# EAGLE design MidiSwitchPCB (EAGLE 6.5.0)
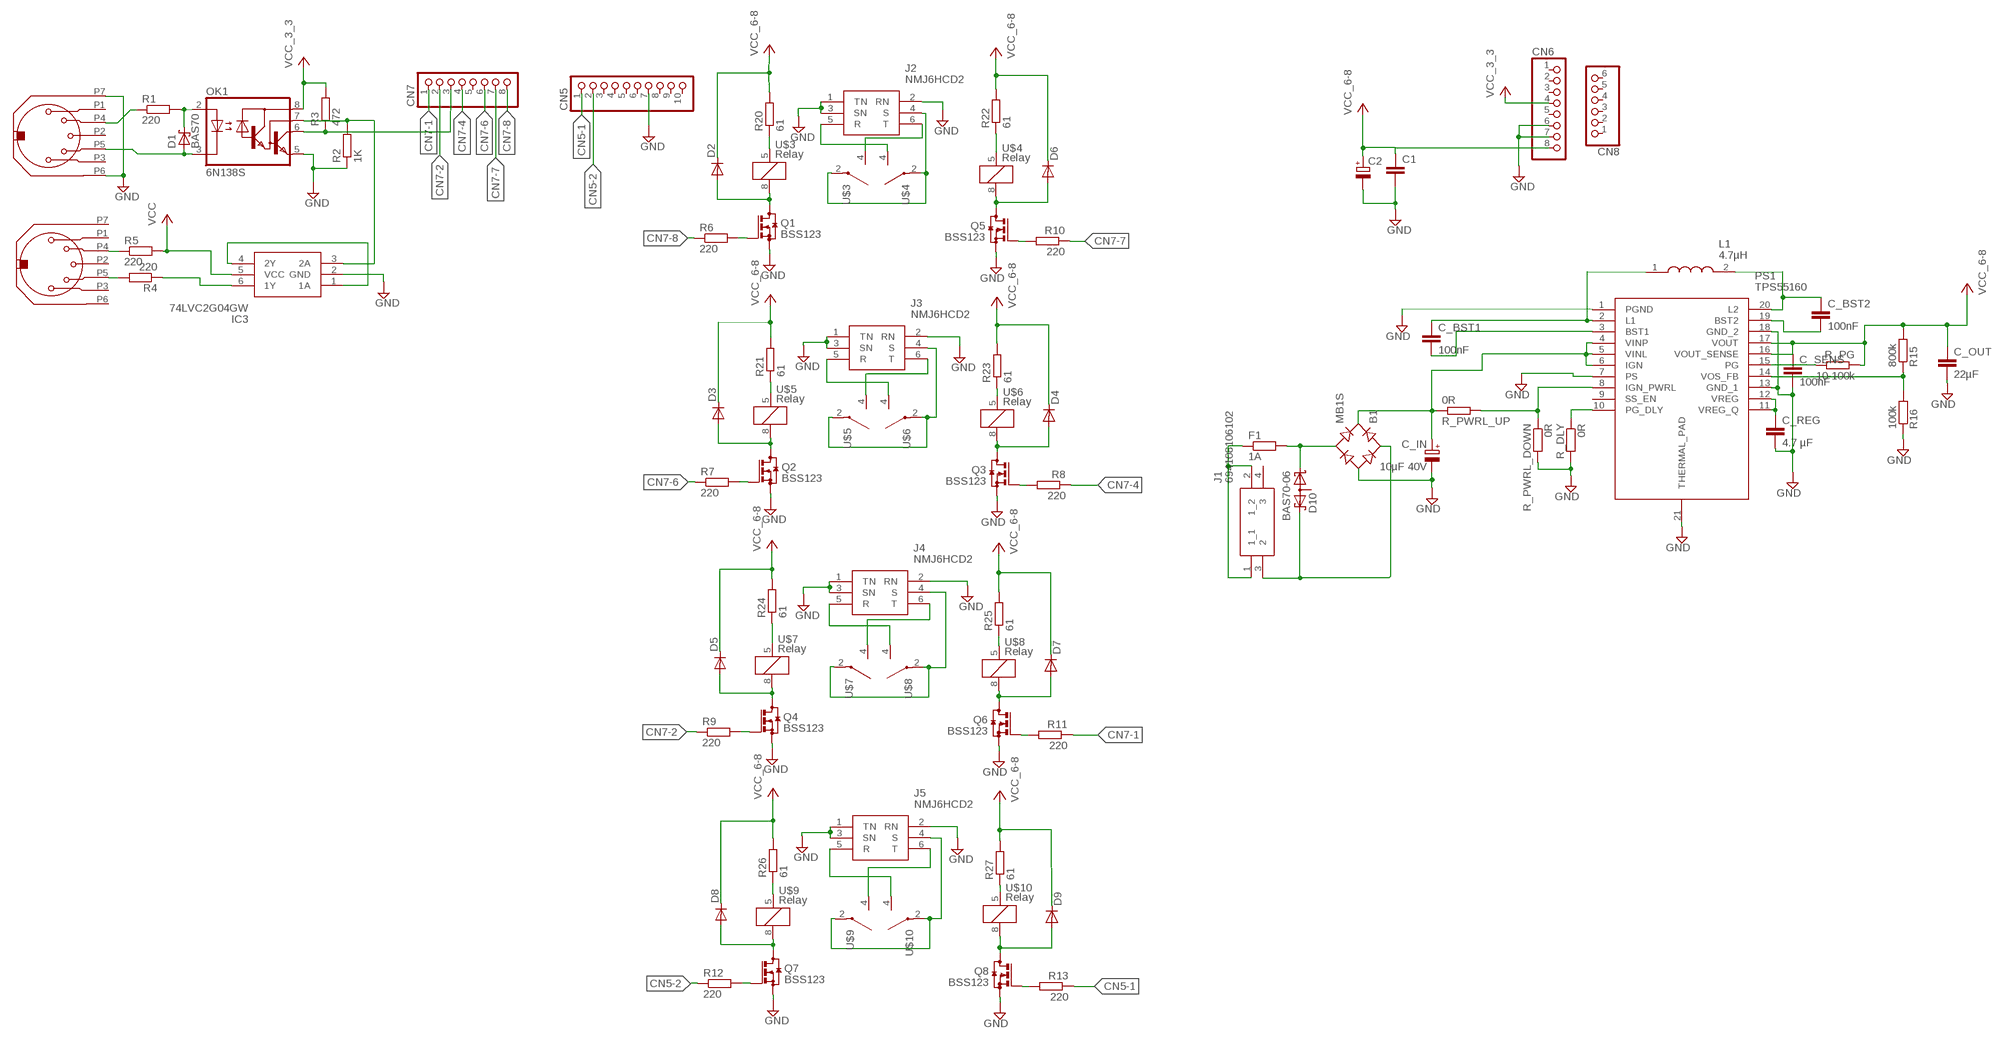
[diagram p0: schematic, sheet 1]

## Parts
B1  MB1S  [SOIC-4]
C1  C-EUC0603  [C0603]
C2  CPOL-EU153CLV-1012  [153CLV-1012]
C_BST1  100nF  C-EUC1206  [C1206]
C_BST2  100nF  C-EUC1206  [C1206]
C_IN  10µF 40V  CPOL-EU153CLV-0605  [153CLV-0605]
C_OUT  22µF  C-EUC1210K  [C1210K]
C_REG  4.7 µF  C-EUC0805  [C0805]
C_SENS  100nF  C-EUC0603  [C0603]
CN5  PINHD-1X10  [1X10]
CN6  PINHD-1X8  [1X08]
CN7  PINHD-1X8  [1X08]
CN8  PINHD-1X6  [1X06]
D1  BAS70  [SOT23]
D2  DIODE-DO-214AC  [DO-214AC]
D3  DIODE-DO-214AC  [DO-214AC]
D4  DIODE-DO-214AC  [DO-214AC]
D5  DIODE-DO-214AC  [DO-214AC]
D6  DIODE-DO-214AC  [DO-214AC]
D7  DIODE-DO-214AC  [DO-214AC]
D8  DIODE-DO-214AC  [DO-214AC]
D9  DIODE-DO-214AC  [DO-214AC]
D10  BAS70-06  [SOT23]
F1  1A  R-EU_R0603  [R0603]
IC3  74LVC2G04GW  74LVC2G04GW,125  [SOT65P210X110-6N]
J1  694108106102  [694108106102]
J2  NMJ6HCD2  [NMJ6HCD2]
J3  NMJ6HCD2  [NMJ6HCD2]
J4  NMJ6HCD2  [NMJ6HCD2]
J5  NMJ6HCD2  [NMJ6HCD2]
L1  4.7µH  NRS8030T4R7MJGJ  [NRS8030T4R7MJGJ]
MIDI-IN  MIDI_CONNECTOR  [MIDI_CONNECTOR_PAC]
MIDI-THRU  MIDI_CONNECTOR  [MIDI_CONNECTOR_PAC]
OK1  6N138S  [DIL8-SMD]
PS1  TPS55160  TPS55160QPWPTQ1  [SOP65P640X120-21N]
Q1  BSS123  [SOT23]
Q2  BSS123  [SOT23]
Q3  BSS123  [SOT23]
Q4  BSS123  [SOT23]
Q5  BSS123  [SOT23]
Q6  BSS123  [SOT23]
Q7  BSS123  [SOT23]
Q8  BSS123  [SOT23]
R1  220  R-EU_R0603  [R0603]
R2  1K  R-EU_R0603  [R0603]
R3  472  R-EU_R0603  [R0603]
R4  220  R-EU_R0603  [R0603]
R5  220  R-EU_R0603  [R0603]
R6  220  R-EU_R0603  [R0603]
R7  220  R-EU_R0603  [R0603]
R8  220  R-EU_R0603  [R0603]
R9  220  R-EU_R0603  [R0603]
R10  220  R-EU_R0603  [R0603]
R11  220  R-EU_R0603  [R0603]
R12  220  R-EU_R0603  [R0603]
R13  220  R-EU_R0603  [R0603]
R15  800k  R-EU_R0603  [R0603]
R16  100k  R-EU_R0603  [R0603]
R20  61  R-EU_R0603  [R0603]
R21  61  R-EU_R0603  [R0603]
R22  61  R-EU_R0603  [R0603]
R23  61  R-EU_R0603  [R0603]
R24  61  R-EU_R0603  [R0603]
R25  61  R-EU_R0603  [R0603]
R26  61  R-EU_R0603  [R0603]
R27  61  R-EU_R0603  [R0603]
R_DLY  0R  R-EU_R0603  [R0603]
R_PG  10-100k  R-EU_R0603  [R0603]
R_PWRL_DOWN  0R  R-EU_R0603  [R0603]
R_PWRL_UP  0R  R-EU_R0603  [R0603]
U$3  Relay  G6L-1F-TR_DC5-NEW  [G6L1FTRDC5]
U$4  Relay  G6L-1F-TR_DC5-NEW  [G6L1FTRDC5]
U$5  Relay  G6L-1F-TR_DC5-NEW  [G6L1FTRDC5]
U$6  Relay  G6L-1F-TR_DC5-NEW  [G6L1FTRDC5]
U$7  Relay  G6L-1F-TR_DC5-NEW  [G6L1FTRDC5]
U$8  Relay  G6L-1F-TR_DC5-NEW  [G6L1FTRDC5]
U$9  Relay  G6L-1F-TR_DC5-NEW  [G6L1FTRDC5]
U$10  Relay  G6L-1F-TR_DC5-NEW  [G6L1FTRDC5]

## Nets
CN5-1: CN5.1 R13.1
CN5-2: CN5.2 R12.1
CN7-1: CN7.1 R11.1
CN7-2: CN7.2 R9.1
CN7-4: CN7.4 R8.1
CN7-6: CN7.6 R7.1
CN7-7: CN7.7 R10.1
CN7-8: CN7.8 R6.1
GND [Power]: B1.- C1.2 C2.- C_IN.- C_OUT.2 C_REG.2 C_SENS.2 CN5.7 CN6.6 CN6.7 IC3.2(GND) J2.1(TN) J2.2(RN) J2.3(SN) J3.1(TN) J3.2(RN) J3.3(SN) J4.1(TN) J4.2(RN) J4.3(SN) J5.1(TN) J5.2(RN) J5.3(SN) MIDI-IN.P6 MIDI-IN.P7 OK1.5(GND) PS1.1(PGND) PS1.7(PS) PS1.13(GND_1) PS1.18(GND_2) PS1.21(THERMAL_PAD) Q1.2(S) Q2.2(S) Q3.2(S) Q4.2(S) Q5.2(S) Q6.2(S) Q7.2(S) Q8.2(S) R2.1 R16.1 R_DLY.2 R_PWRL_DOWN.2
MIDI_RX: IC3.3(2A) OK1.7(VB) R2.2
N$1: IC3.1(1A) IC3.4(2Y)
N$2: J2.6(T) U$3.4(S)
N$3 [WideIsolation]: MIDI-IN.P4 R1.1
N$4: J2.5(R) U$4.4(S)
N$5: MIDI-THRU.P4 R5.1
N$6: J3.6(T) U$5.4(S)
N$7 [WideIsolation]: D1.3(C) OK1.2(A) R1.2
N$8 [WideIsolation]: D1.1(A) MIDI-IN.P5 OK1.3(C)
N$9: CN7.3 OK1.6(VO) R3.1
N$10: MIDI-THRU.P5 R4.2
N$11: IC3.6(1Y) R4.1
N$12: D2.A Q1.3(D) U$3.8
N$13: D3.A Q2.3(D) U$5.8
N$14: Q1.1(G) R6.2
N$15: Q2.1(G) R7.2
N$16: D4.A Q3.3(D) U$6.8
N$17: Q3.1(G) R8.2
N$19: J3.5(R) U$6.4(S)
N$20: D6.A Q5.3(D) U$4.8
N$21: Q5.1(G) R10.2
N$22: J4.6(T) U$7.4(S)
N$23: J3.4(S) U$5.2(P) U$6.2(P)
N$24: D5.A Q4.3(D) U$7.8
N$25: Q4.1(G) R9.2
N$26: D7.A Q6.3(D) U$8.8
N$27: Q6.1(G) R11.2
N$28: J4.5(R) U$8.4(S)
N$29: J5.6(T) U$9.4(S)
N$30: J5.5(R) U$10.4(S)
N$32: J4.4(S) U$7.2(P) U$8.2(P)
N$33: D8.A Q7.3(D) U$9.8
N$34: Q7.1(G) R12.2
N$35: D9.A Q8.3(D) U$10.8
N$36 [ESD_Critical]: B1.~2(AC2) D10.1(K1) F1.2
N$37 [ESD_Critical]: B1.~1(AC1) D10.2(K2) J1.3
N$38: J2.4(S) U$3.2(P) U$4.2(P)
N$39: Q8.1(G) R13.2
N$40 [ESD_Critical]: F1.1 J1.1(1_1) J1.2(1_2)
N$41 [Power]: B1.+ C_IN.+ PS1.4(VINP) PS1.5(VINL) PS1.6(IGN) R_PWRL_UP.1
N$43: J5.4(S) U$9.2(P) U$10.2(P)
N$48: PS1.10(PG_DLY) R_DLY.1
N$49: PS1.14(VOS_FB) R15.1 R16.2
N$51 [Power]: C_BST2.1 L1.2 PS1.20(L2)
N$52: PS1.15(PG) R_PG.2
N$53: R23.1 U$6.5
N$54: C_BST2.2 PS1.19(BST2)
N$55 [Power]: C_BST1.1 L1.1 PS1.2(L1)
N$56 [Power]: C_BST1.2 PS1.3(BST1)
N$57: C_REG.1 PS1.11(VREG_Q) PS1.12(VREG)
N$58: PS1.8(IGN_PWRL) R_PWRL_DOWN.1 R_PWRL_UP.2
N$59: R20.1 U$3.5
N$60: R22.1 U$4.5
N$61: R21.1 U$5.5
N$62: R27.1 U$10.5
N$63: R24.1 U$7.5
N$64: R25.1 U$8.5
N$65: R26.1 U$9.5
VCC_3_3: CN6.4 IC3.5(VCC) OK1.8(VCC) R3.2 R5.2 ; supply symbol labelled VCC
VCC_6-8 [Power]: C1.1 C2.+ C_OUT.1 C_SENS.1 CN6.8 D2.C D3.C D4.C D5.C D6.C D7.C D8.C D9.C PS1.16(VOUT_SENSE) PS1.17(VOUT) R15.2 R20.2 R21.2 R22.2 R23.2 R24.2 R25.2 R26.2 R27.2 R_PG.1
Unconnected: CN5.3 CN5.4 CN5.5 CN5.6 CN5.8 CN5.9 CN5.10 CN6.1 CN6.2 CN6.3 CN6.5 CN7.5 CN8.1 CN8.2 CN8.3 CN8.4 CN8.5 CN8.6 D10.3(AA) J1.4 MIDI-IN.P1 MIDI-IN.P2 MIDI-IN.P3 MIDI-THRU.P1 MIDI-THRU.P2 MIDI-THRU.P3 MIDI-THRU.P6 MIDI-THRU.P7 PS1.9(SS_EN)

## Library data of the parts
B1 = rectifier:MB*S: Bridge Rectifier Source: http://www.fairchildsemi.com/ds/MB/MB6S.pdf
C1 C_BST1 C_BST2 C_OUT C_REG C_SENS = rcl:C-EU: CAPACITOR, European symbol
C2 C_IN = rcl:CPOL-EU: POLARIZED CAPACITOR, European symbol
CN5 = pinhead:PINHD-1X10: PIN HEADER
CN6 CN7 = pinhead:PINHD-1X8: PIN HEADER
CN8 = pinhead:PINHD-1X6: PIN HEADER
D1 = diode:BAS70: Silicon Schottky Diodes General-purpose diode for high-speed switching
D2-D9 = diode:DIODE-: DIODE
D10 = diode:BAS70-06: Silicon Schottky Diodes General-purpose diode for high-speed switching
F1 R1-R13 R15 R16 R20-R27 R_DLY R_PG R_PWRL_DOWN R_PWRL_UP = rcl:R-EU_: RESISTOR, European symbol
IC3 = 74LVC2G04GW_125:74LVC2G04GW,125: NEXPERIA - 74LVC2G04GW,125 - INVERTER GATE, 2 I/P, SC-88-6 Source: Datasheet <https://componentsearchengine.com/Datasheets/1/74LVC2G04GW,125.pdf>; DESCRIPTION: NEXPERIA - 74LVC2G04GW,125 - INVERTER GATE, 2 I/P, SC-88-6; HEIGHT: 1.1mm; MANUFACTURER_NAME: Nexperia; MANUFACTURER_PART_NUMBER: 74LVC2G04GW,125; MOUSER_PART_NUMBER: 771-74LVC2G04GW-G; MOUSER_PRICE-STOCK: https://www.mouser.com/Search/Refine.aspx?Keyword=771-74LVC2G04GW-G
J1 = SamacSys_Parts:694108106102: WURTH ELEKTRONIK - 694108106102 - CONNECTOR, POWER ENTRY, JACK, 5A, 24VDC Source: Datasheet <https://componentsearchengine.com/Datasheets/1/694108106102.pdf>; DESCRIPTION: WURTH ELEKTRONIK - 694108106102 - CONNECTOR, POWER ENTRY, JACK, 5A, 24VDC; HEIGHT: 11mm; MANUFACTURER_NAME: Wurth Elektronik; MANUFACTURER_PART_NUMBER: 694108106102; MOUSER_PART_NUMBER: 710-694108106102; MOUSER_PRICE-STOCK: https://www.mouser.com/Search/Refine.aspx?Keyword=710-694108106102
J2-J5 = NMJ6HCD2:NMJ6HCD2: Phone Connectors STEREO CHROME NOSE Source: Datasheet <http://www.neutrik.de/zoolu-website/media/download/2890/Strichzeichnung NMJ6HCD2>; DESCRIPTION: Phone Connectors STEREO CHROME NOSE; HEIGHT: mm; MANUFACTURER_NAME: Neutrik; MANUFACTURER_PART_NUMBER: NMJ6HCD2; MOUSER_PART_NUMBER: 550-22302; MOUSER_PRICE-STOCK: https://www.mouser.com/Search/Refine.aspx?Keyword=550-22302
L1 = NRS8030T4R7MJGJ:NRS8030T4R7MJGJ: Fixed Inductors 8030 4.7uH 28.6mOhms +/-20%Tol 3600mA Source: Datasheet <https://componentsearchengine.com/Datasheets/1/NRS8030T4R7MJGJ.pdf>; DESCRIPTION: Fixed Inductors 8030 4.7uH 28.6mOhms +/-20%Tol 3600mA; HEIGHT: 3mm; MANUFACTURER_NAME: TAIYO YUDEN; MANUFACTURER_PART_NUMBER: NRS8030T4R7MJGJ; MOUSER_PART_NUMBER: 963-NRS8030T4R7MJGJ; MOUSER_PRICE-STOCK: https://www.mouser.com/Search/Refine.aspx?Keyword=963-NRS8030T4R7MJGJ
MIDI-IN MIDI-THRU = MidiSwitchParts:MIDI_CONNECTOR
OK1 = 6N138S:6N138S
PS1 = TPS55160QPWPTQ1:TPS55160QPWPTQ1: 3.6V to 36V, 1A output, 2MHz, synchronous buck-boost converter, AEC-Q100 qualified Source: Datasheet <http://www.ti.com/lit/gpn/TPS55160-Q1>; DESCRIPTION: 3.6V to 36V, 1A output, 2MHz, synchronous buck-boost converter, AEC-Q100 qualified; HEIGHT: 1.2mm; MANUFACTURER_NAME: Texas Instruments; MANUFACTURER_PART_NUMBER: TPS55160QPWPTQ1
Q1-Q8 = transistor-small-signal:BSS123: N-CHANNEL MOS FET
U$3-U$10 = SamacSys_Parts:G6L-1F-TR_DC5-NEW

## Net classes
0 default: width 0.152 mm, drill 0.356 mm, clearance 0.152 mm
1 Power: width 1.016 mm, drill 0.356 mm, clearance 0.406 mm
2 Signal: width 0.152 mm, drill 0.356 mm, clearance 0.152 mm
3 WideIsolation: width 0.152 mm, drill 0.356 mm, clearance 2.032 mm
4 ESD_Critical: width 0.152 mm, drill 0.356 mm, clearance 0.61 mm

## Board
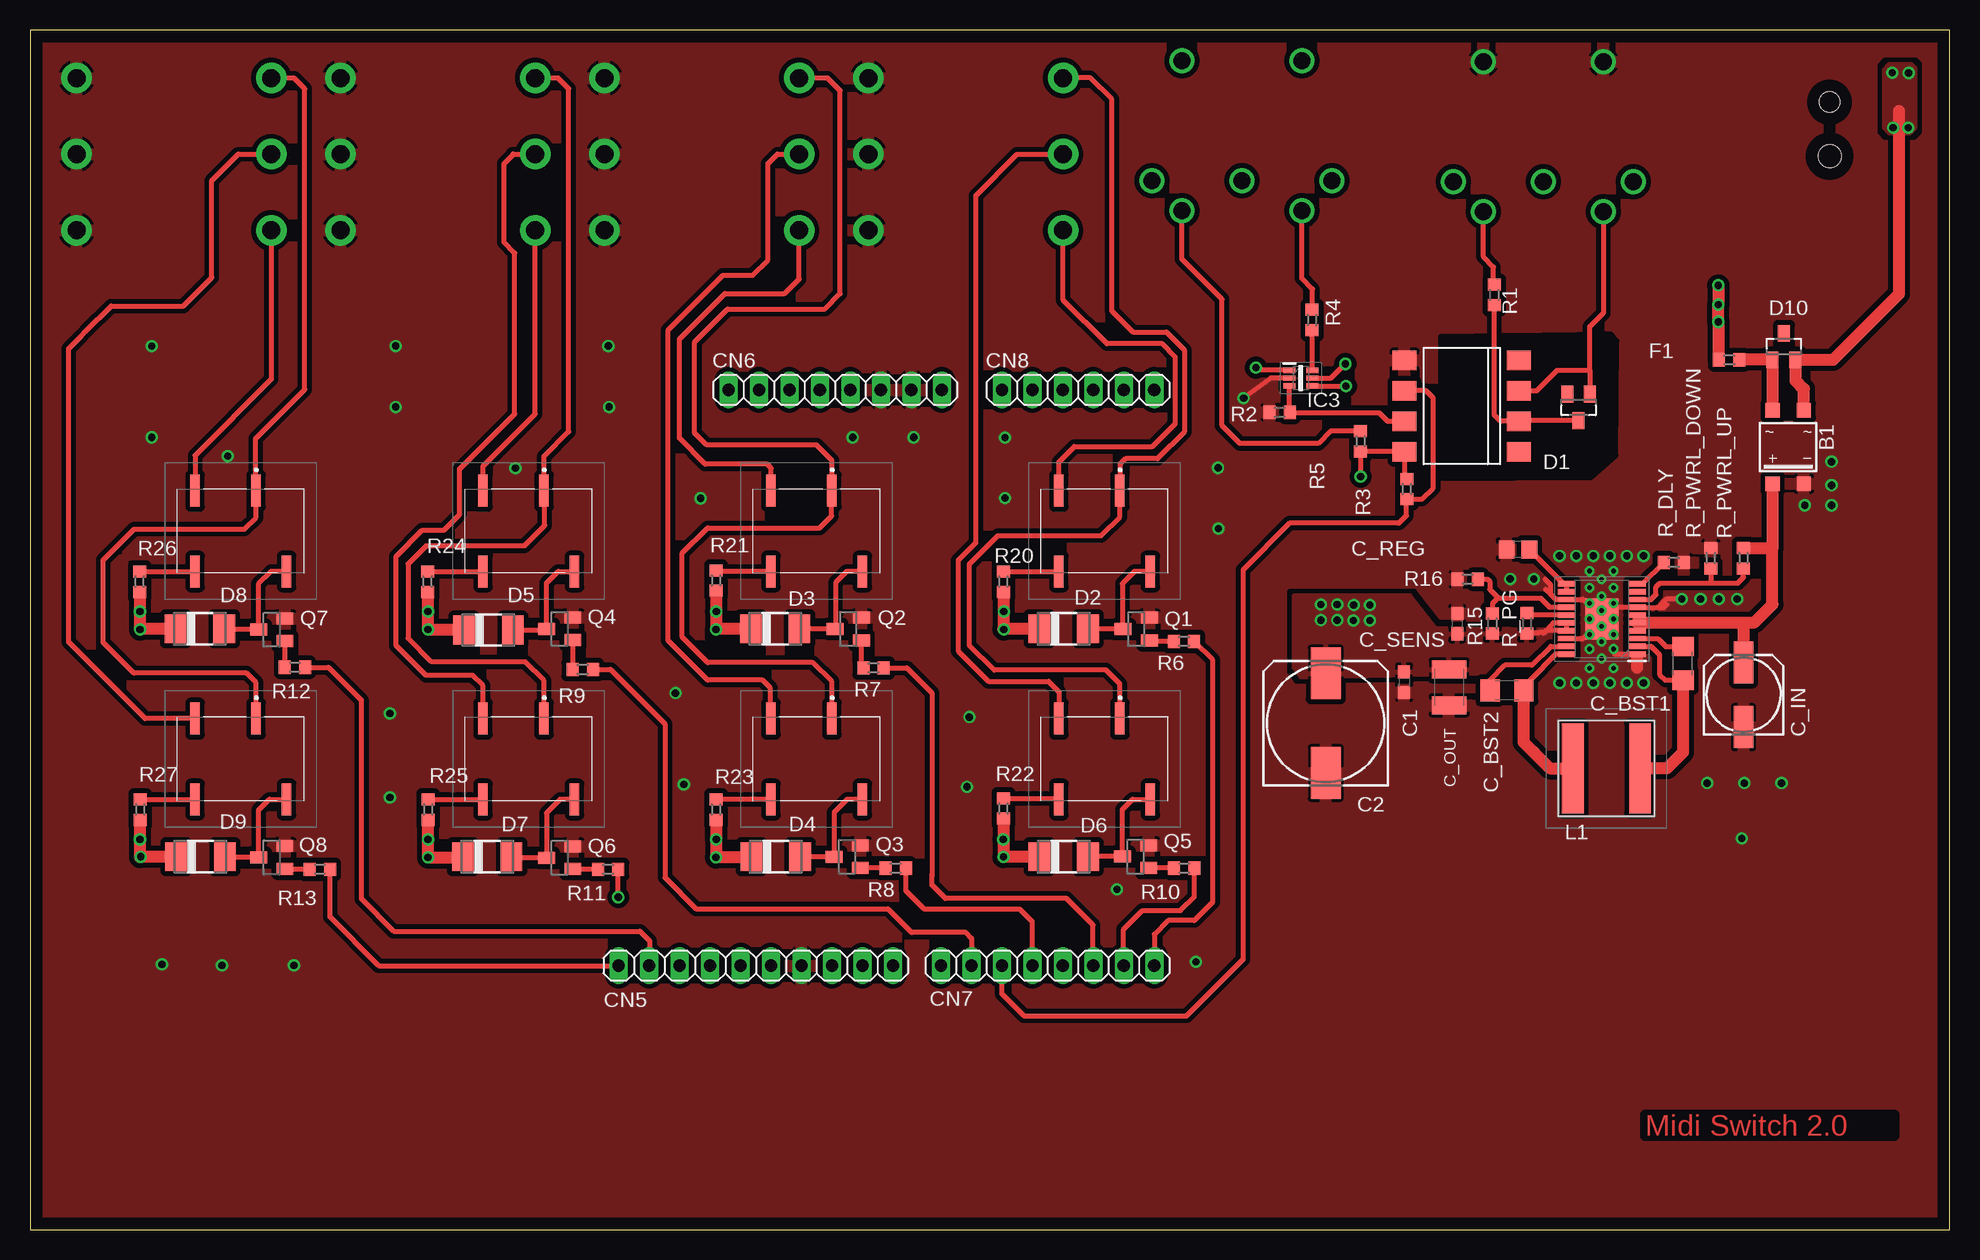
[diagram p1: board, top side]
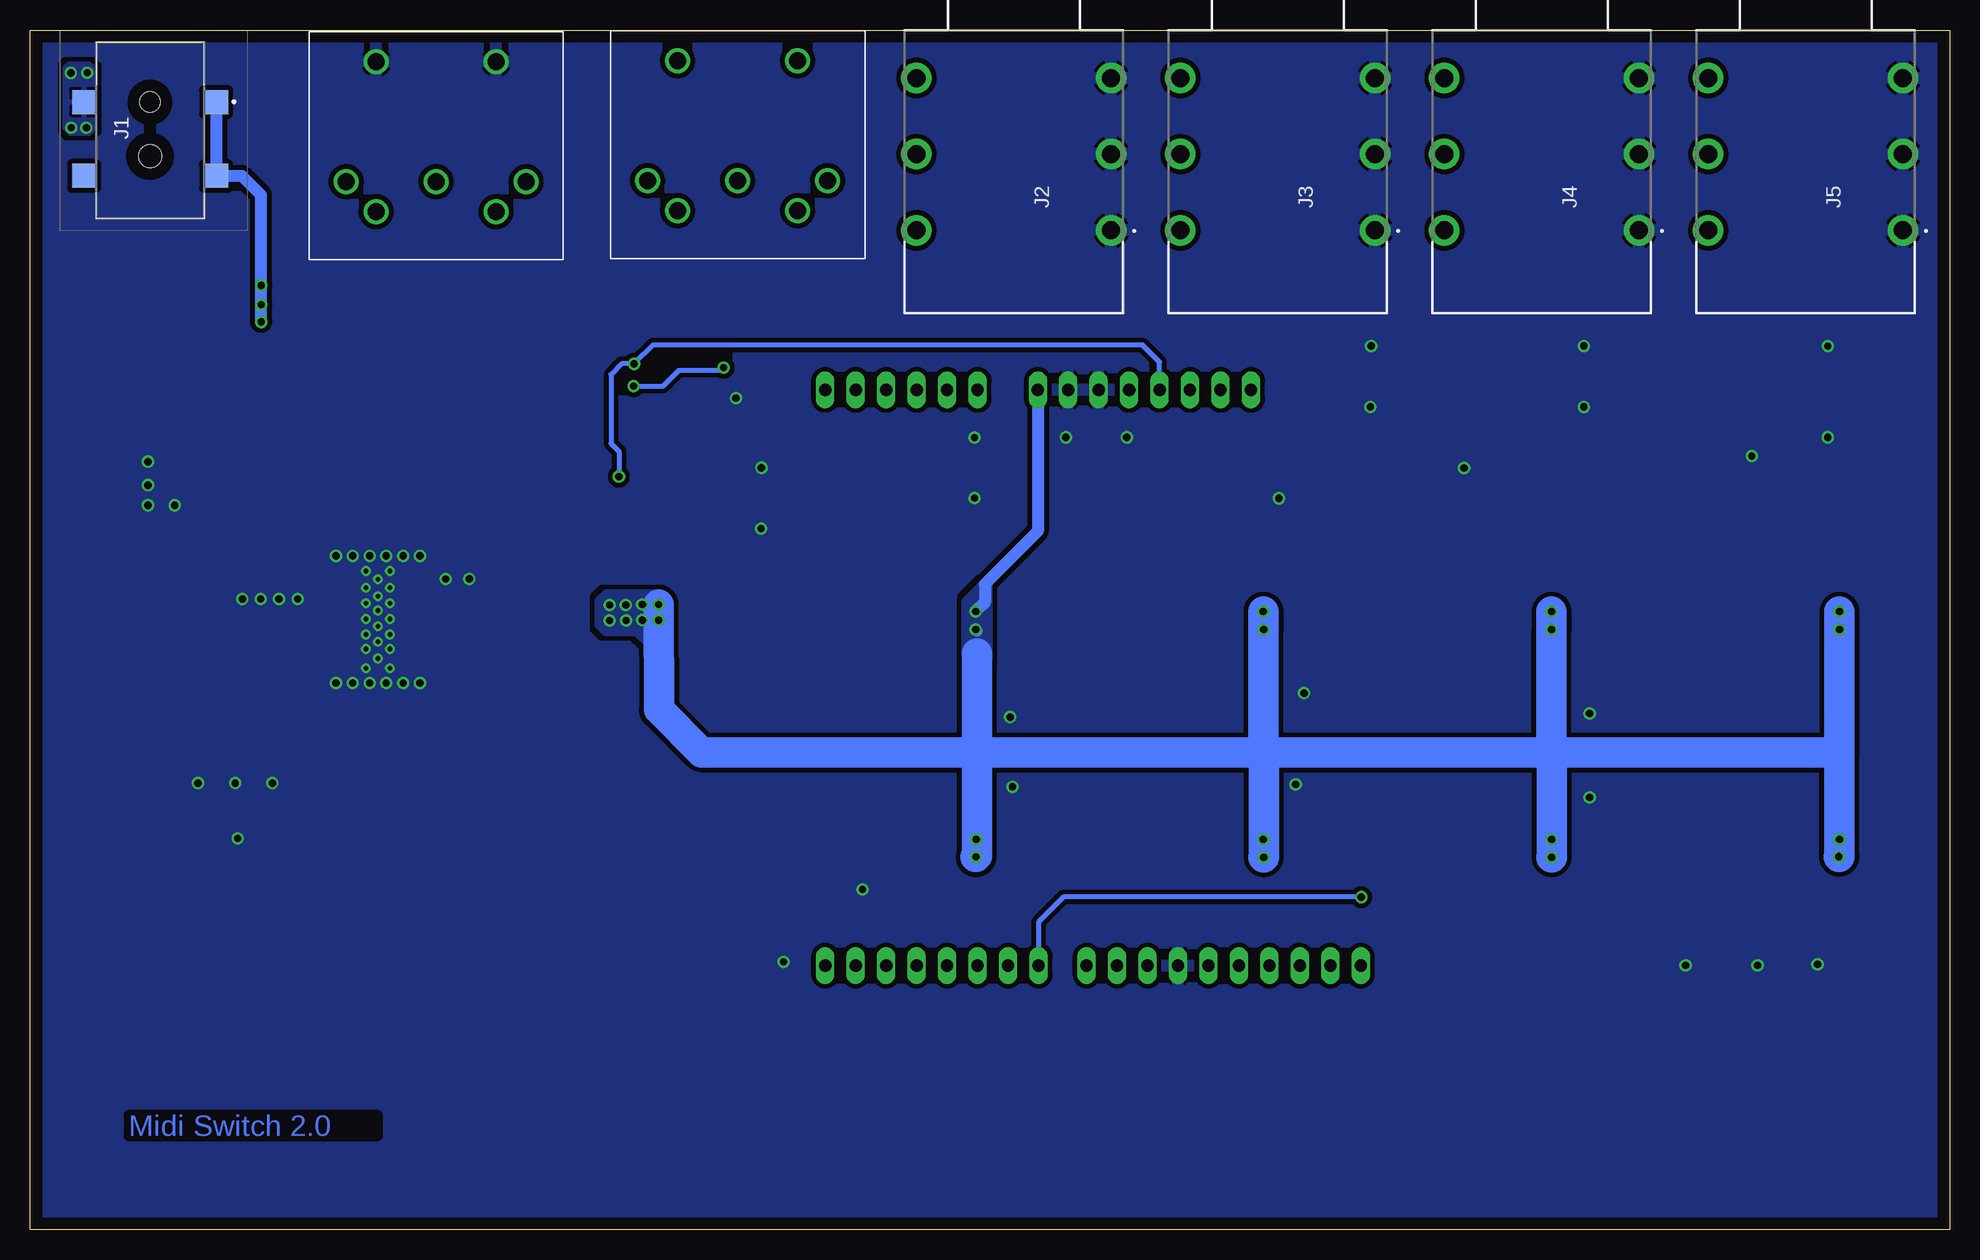
[diagram p2: board, bottom side, seen from below]

Size 160 x 100 mm. Coordinates in mm from the lower left corner, seen from the top.
Outline: 0,0 160,0 160,100 0,100 0,0
Copper layers (1*16): Top 0.035mm / dielectric 1.5mm / Bottom 0.035mm
Design rules "default *": minimum track width 6mil, minimum drill 14mil, track to track 6mil, track to pad 6mil, pad to pad 6mil, via to via 6mil, smd to smd 6mil, copper to edge 40mil, drill to drill 8mil, minimum pad ring 10mil, minimum via ring 8mil, stop-mask expansion 4mil, vias tented up to drill 0mil, thermal gap 10mil

### Footprints (pad centres in the part's own frame; a part is rotated, then mirrored left to right if it is on the bottom)
SOIC-4 = smd 1.2 x 1.2: + 1.3,3.05; - -1.3,3.05; ~1 -1.3,-3.05; ~2 1.3,-3.05
C0603 = smd 1.1 x 1: 1 -0.85,0; 2 0.85,0
153CLV-1012 = smd 4.3 x 2.5: + 4.15,0; - -4.15,0
C1206 = smd 1.6 x 1.8: 1 -1.4,0; 2 1.4,0
153CLV-0605 = smd 3.5 x 1.6: + 2.7,0; - -2.7,0
C1210K = smd 1.5 x 2.9: 1 -1.5,0; 2 1.5,0
C0805 = smd 1.3 x 1.5: 1 -0.95,0; 2 0.95,0
1X10 = drill 1.016 long: 1 -11.43,0; 2 -8.89,0; 3 -6.35,0; 4 -3.81,0; 5 -1.27,0; 6 1.27,0; 7 3.81,0; 8 6.35,0; 9 8.89,0; 10 11.43,0
1X08 = drill 1.016 long: 1 -8.89,0; 2 -6.35,0; 3 -3.81,0; 4 -1.27,0; 5 1.27,0; 6 3.81,0; 7 6.35,0; 8 8.89,0
1X06 = drill 1.016 long: 1 -6.35,0; 2 -3.81,0; 3 -1.27,0; 4 1.27,0; 5 3.81,0; 6 6.35,0
SOT23 = smd 1 x 1.4: 1 -0.95,-1.1; 2 0.95,-1.1; 3 0,1.1
DO-214AC = smd 1.8 x 2.4: A 2.025,0; C -2.025,0
R0603 = smd 1 x 1.1: 1 -0.85,0; 2 0.85,0
SOT65P210X110-6N = smd 1 x 0.45: 1 -0.95,0.65; 2 -0.95,0; 3 -0.95,-0.65; 4 0.95,-0.65; 5 0.95,0; 6 0.95,0.65
694108106102 = smd 2 x 2: 1 -3.075,5.5; 2 3.075,5.5; 3 -3.075,-5.5; 4 3.075,-5.5 | hole 1.7: -3.075,0 | hole 1.9: 1.425,0
NMJ6HCD2 = drill 1.5 pad 2.54: 1 -16.7,-8.115; 2 -10.35,-8.115; 3 -4,-8.115; 4 -4,8.115; 5 -10.35,8.115; 6 -16.7,8.115
NRS8030T4R7MJGJ = smd 1.8 x 7.5: 1 -2.8,0; 2 2.8,0
MIDI_CONNECTOR_PAC = drill 1.4: P1 7.5,0; P2 0,0; P3 -7.5,0; P4 5,-2.5; P5 -5,-2.5; P6 5,10; P7 -5,10
DIL8-SMD = smd 1.6 x 2: 1 -3.81,-4.77; 2 -1.27,-4.77; 3 1.27,-4.77; 4 3.81,-4.77; 5 3.81,4.77; 6 1.27,4.77; 7 -1.27,4.77; 8 -3.81,4.77
SOP65P640X120-21N = smd 1.475 x 0.45: 1 -2.938,2.925; 2 -2.938,2.275; 3 -2.938,1.625; 4 -2.938,0.975; 5 -2.938,0.325; 6 -2.938,-0.325; 7 -2.938,-0.975; 8 -2.938,-1.625; 9 -2.938,-2.275; 10 -2.938,-2.925; 11 2.938,-2.925; 12 2.938,-2.275; 13 2.938,-1.625; 14 2.938,-0.975; 15 2.938,-0.325; 16 2.938,0.325; 17 2.938,0.975; 18 2.938,1.625; 19 2.938,2.275; 20 2.938,2.925 | smd 2.75 x 3.43: 21 0,0
G6L1FTRDC5 = smd 0.8 x 2.66: 2 -1.27,-3.37; 4 3.81,-3.37; 5 3.81,3.37; 8 -3.81,3.37

### Placement (x,y rotation side)
B1  146.56,65.23 180 top
C1  114.53,45.63 270 top
C2  108,42.21 90 top
C_BST1  137.78,47.19 90 top
C_BST2  123.11,44.94 180 top
C_IN  142.84,44.58 90 top
C_OUT  118.29,45.2 270 top
C_REG  124.03,56.69 180 top
C_SENS  118.98,50.51 90 top
CN5  60.5,22 0 top
CN6  67.11,70 0 top
CN7  84.82,22 0 top
CN8  87.36,70 0 top
D1  129.08,68.55 180 top
D2  86.16,50.08 0 top
D3  62.11,50.08 0 top
D4  62.16,31.08 0 top
D5  38.21,49.98 0 top
D6  86.16,31.08 0 top
D7  38.11,31.08 0 top
D8  14.16,50.08 0 top
D9  14.21,31.08 0 top
D10  146.2,73.6 0 top
F1  141.64,72.5 0 top
IC3  105.93,70.98 0 top
J1  150,90.91 270 bottom
J2  77.99,100 90 bottom
J3  55.99,100 90 bottom
J4  34,100 90 bottom
J5  12,100 90 bottom
L1  131.41,38.45 180 top
MIDI-IN  126.15,87.36 0 bottom
MIDI-THRU  101.01,87.43 0 bottom
OK1  119.35,68.65 90 top
PS1  131.03,50.89 180 top
Q1  92.21,50.06 90 top
Q2  68.21,50.07 90 top
Q3  68.11,31.08 90 top
Q4  44.15,50.08 90 top
Q5  92.15,31.09 90 top
Q6  44.15,31 90 top
Q7  20.15,50.01 90 top
Q8  20.15,31.02 90 top
R1  122.06,77.91 270 top
R2  104.16,68.13 0 top
R3  114.77,61.73 90 top
R4  106.87,75.82 90 top
R5  110.91,65.71 270 top
R6  96.19,49.03 180 top
R7  70.32,46.82 180 top
R8  72.15,30.13 180 top
R9  46.07,46.69 180 top
R10  96.21,30.13 180 top
R11  48.19,30.03 180 top
R12  22.08,46.87 180 top
R13  24.17,30.03 180 top
R15  121.9,50.52 270 top
R16  119.84,54.21 0 top
R20  81.14,54.01 270 top
R21  57.19,54.11 270 top
R22  81.14,35.11 270 top
R23  57.19,35.01 270 top
R24  33.14,54.01 270 top
R25  33.19,35.01 270 top
R26  9.14,54.01 270 top
R27  9.19,35.01 270 top
R_DLY  137.02,55.61 0 top
R_PG  124.78,50.53 90 top
R_PWRL_DOWN  140.1,55.97 90 top
R_PWRL_UP  142.82,55.97 270 top
U$3  89.57,58.23 180 top
U$4  89.57,39.23 180 top
U$5  65.57,58.23 180 top
U$6  65.57,39.23 180 top
U$7  41.57,58.23 180 top
U$8  41.57,39.23 180 top
U$9  17.57,58.23 180 top
U$10  17.57,39.23 180 top

### Tracks (layer width: path | path; a pad name or v marks a point on that pad's centre or on a via)
CN5-1
  Top 0.406: R13.1 25.01,30.02 25.01,26.06 29.07,22 CN5.1
CN5-2
  Top 0.406: R12.1 24.88,46.87 27.63,44.12 27.63,27.56 30.32,24.87 50.85,24.87 51.66,24.05 51.66,22.05 CN5.2
CN7-1  (via drill 0.6)
  Top 0.406: v49.04,27.71 R11.1
  Bottom 0.406: CN7.1 75.94,25.63 73.85,27.71 v49.04,27.71
CN7-2
  Top 0.406: R9.1 48.38,46.69 52.92,42.14 52.92,29.34 55.52,26.75 71.52,26.75 73.5,24.77 78,24.77 78.49,24.28 78.49,22.02 CN7.2
CN7-4
  Top 0.406: R8.1 73.02,30.11 73.02,28.25 74.54,26.72 82.5,26.72 83.54,25.68 CN7.4
CN7-6
  Top 0.406: R7.1 73.09,46.82 75.17,44.73 75.17,29.6 75.17,29.44 75.17,28.73 76.3,27.6 86.4,27.6 88.61,25.39 88.61,22.02 CN7.6
CN7-7
  Top 0.406: R10.1 97.04,30.11 97.04,27.73 95.91,26.59 92.73,26.59 91.16,25.02 CN7.7
CN7-8
  Top 0.406: R6.1 98.59,47.47 98.59,27.3 97.04,25.76 94.87,25.76 93.73,24.61 93.73,22.02 CN7.8
GND  (via drill 0.4, 0.6)
  Top 0.406: PS1.18 129.46,49.27 130.41,50.22 130.41,50.27 PS1.21 | PS1.21 132,51.87 PS1.7 135.71,51.87 136.45,52.6 137.72,52.6 | PS1.21 130.61,51.31 130.61,51.39 129.47,52.53 127.6,52.53 127.59,52.52 | PS1.13 127.59,52.52 | 127.59,52.52 127.17,52.52 126.75,52.94 | 126.75,52.94 126.75,53.75 126.29,54.21 | 126.75,52.94 126.32,53.37 | IC3.2 103.43,70.98 v101.16,69.32 | 135.64,51.87 136.22,51.87 136.45,52.09 | PS1.1 133.96,47.68 | 133.99,47.95 132.08,47.95
  Top 1.016: 133.96,46.84 133.96,47.68
  other vias: 137.68,52.57 133.1,56.16 131.7,56.16 130.3,56.16 127.5,56.16 125.35,54.22 123.38,54.24 146,37.21 142.9,37.21 139.8,37.21 150.16,64.01 150.16,62.05 150.16,60.38 142.7,32.61 81.27,66.01 81.27,60.99 10.15,73.63 10.15,66.04 55.9,60.96 30.48,73.66 30.48,68.58 48.21,73.66 48.26,68.58 73.66,66.04 68.58,66.04 99.03,63.5 99.06,58.45 139.25,52.57 140.78,52.57 142.3,52.57 128.9,56.16 134.5,56.16 90.6,28.35 147.93,60.38 130,53.5 132,50.9 132,53.5 131,52.8 130,52.2 131,51.6 132,52.2 130,50.9 131,50.3 130,49.6 132,49.6 131,49 130,48.4 132,48.4 131,54.2 131,47.6 130,54.9 132,54.9 132,46.8 130,46.8 133.1,45.56 131.7,45.56 130.3,45.56 127.5,45.56 128.9,45.56 134.5,45.56 40.46,63.48 16.48,64.48 22,22.01 11,22.11 16,22.01 30,36.01 30,43.01 53.8,44.71 54.5,37.11 78.1,36.91 78.3,42.71 97.2,22.31
  pour Top (rank 6): 1,99 160,99 160,0 1,1
  pour Bottom (rank 6): 159.98,99.01 159.98,-0.01 0.99,0.99 0.99,99.01
  pour Top (no thermals): 129.03,53.9 133.02,53.9 133.02,47.9 129.03,47.93
MIDI_RX
  Top 0.406: 104.94,70.3 IC3.3 104.98,68.16 R2.2 105.04,68.1 112.44,68.1 113.17,67.38 OK1.7
N$1  (via drill 0.6)
  Top 0.406: IC3.4 109.67,70.33 v109.68,70.32 | IC3.1 102.4,71.63 v102.19,71.85
  Bottom 0.406: v109.68,70.32 107.22,70.32 105.91,71.64 102.4,71.64 v102.19,71.85
N$2
  Top 0.406: U$3.4 85.76,63.99 87.05,65.28 93.57,65.28 95.48,67.18 95.48,72.75 94.39,73.84 89.76,73.84 86.11,77.49 J2.6
N$3
  Top 0.406: R1.1 122,78.83 122,80.24 121.15,81.08 MIDI-IN.P4
N$4
  Top 0.406: J2.5 86.1,89.64 82.27,89.64 78.84,86.21 78.84,57.25 77.37,55.78 77.37,48.23 79.91,45.7 84.91,45.7 85.78,44.83 85.78,42.61 U$4.4
N$5
  Top 0.406: R5.1 108.41,66.56 107.38,65.53 100.85,65.53 99.36,67.03 99.36,77.56 96.01,80.9 MIDI-THRU.P4
N$6
  Top 0.406: U$5.4 61.77,61.61 61.77,63.48 61.44,63.8 56.29,63.8 54.13,65.96 54.13,74.22 57.94,78.03 62.92,78.03 64.11,79.22 J3.6
N$7
  Top 0.406: D1.3 124.18,67.45 OK1.2 122.56,67.38 122.05,67.9 122.06,67.92 R1.2
N$8
  Top 0.406: OK1.3 125.59,69.92 127.3,71.64 130.02,71.64 | 130.02,71.64 D1.1 | MIDI-IN.P5 131.15,76.41 130.02,75.28 130.02,71.64
N$9
  Top 0.406: OK1.6 114.59,69.93 116.36,69.93 116.97,69.32 116.97,61.83 116.01,60.88 R3.1 114.73,60.84 114.73,59.52 114.09,58.88 104.99,58.88 101.11,55 101.11,22.51 96.4,17.8 82.86,17.8 81,19.66 CN7.3
N$10
  Top 0.406: R4.2 106.91,76.71 106.91,78.41 106.01,79.31 MIDI-THRU.P5
N$11
  Top 0.406: IC3.6 106.88,73.81 R4.1
N$12
  Top 0.406: U$3.8 92.06,54.86 91.05,53.85 91.05,50.12 Q1.3 88.2,50.06 D2.A
N$13
  Top 0.406: U$5.8 68.08,54.86 67.15,53.92 67.15,50.1 Q2.3 64.14,50.07 D3.A
N$14
  Top 0.406: R6.2 93.39,49.03 Q1.1
N$15
  Top 0.406: 69.4,49.03 Q2.1 69.31,46.97 R7.2
N$16
  Top 0.406: U$6.8 68.11,35.86 67.02,34.77 67.02,31.09 Q3.3 D4.A
N$17
  Top 0.406: R8.2 Q3.1
N$18
  cutout Top: 117.57,74.45 117.57,62.59 130.1,62.67 132.21,64.52 132.28,74.07 131.8,74.63
N$19
  Top 0.406: U$6.4 61.72,42.63 61.72,45.14 61.06,45.8 56.49,45.8 53.19,49.1 53.19,74.98 57.76,79.55 60.25,79.55 61.52,80.82 61.52,88.88 62.29,89.65 J3.5
N$20
  Top 0.406: D6.A Q5.3 91.05,35 91.91,35.87 U$4.8
N$21
  Top 0.406: R10.2 93.26,30.13 Q5.1
N$22
  Top 0.406: U$7.4 37.76,63.64 42.11,67.99 J4.6
N$23
  Top 0.406: U$6.2 66.84,45.67 65.24,47.27 56.48,47.27 54.37,49.38 54.37,56.39 56.48,58.5 65.83,58.5 66.82,59.49 66.82,61.57 U$5.2 66.84,64.11 65.55,65.41 56.4,65.41 55.41,66.4 55.41,73.98 58.17,76.73 66.27,76.73 67.54,78 67.54,94.94 66.48,96 J3.4
N$24
  Top 0.406: D5.A 42.95,49.98 Q4.3 43.05,53.88 44.03,54.86 U$7.8
N$25
  Top 0.406: Q4.1 45.22,49.1 R9.2
N$26
  Top 0.406: U$8.8 44.18,35.86 43.04,34.72 Q6.3 40.22,31 D7.A
N$27
  Top 0.406: R11.2 45.27,30.03 Q6.1
N$28
  Top 0.406: 40.25,89.65 40.3,89.65 | 40.3,89.65 J4.5 | U$8.4 37.76,45.34 36.9,46.2 33,46.2 30.5,48.7 30.5,56.1 32.7,58.3 34.5,58.3 35.8,59.6 35.8,63.4 40.4,68 40.4,81.4 39.5,82.3 39.5,88.85 40.3,89.65
N$29
  Top 0.406: J5.6 20.11,70.89 13.76,64.53 U$9.4
N$30
  Top 0.406: U$10.4 9.6,42.6 3.23,48.97 3.23,73.46 4.29,74.52 4.65,74.88 6.76,76.99 12.78,76.99 15.16,79.38 15.16,87.45 17.36,89.65 J5.5
N$32
  Top 0.406: U$8.2 42.84,45.77 41.29,47.32 33.48,47.32 31.5,49.3 31.5,55.5 33,57 41.2,57 42.9,58.7 42.9,61.54 U$7.2 | U$7.2 42.85,64.45 44.91,66.51 44.91,95.12 44.03,96 J4.4 | 42.88,61.56 U$7.2
N$33
  Top 0.406: U$9.8 20.1,54.86 19.04,53.8 Q7.3 16.25,50.01 D8.A
N$34
  Top 0.406: Q7.1 21.28,49.03 21.23,49.03 R12.2
N$35
  Top 0.406: U$10.8 19.95,35.87 19.05,34.96 Q8.3 16.3,31.02 D9.A
N$36
  Top 1.016: B1.~2 D10.1 F1.2
N$37  (via drill 0.6)
  Top 1.016: B1.~1 147.86,70.07 147.17,70.76 147.17,72.48 D10.2 150.3,72.5 155.8,78 155.8,93.24
  other vias: 155.22,96.44 156.59,96.42 155.3,91.85 156.57,91.85
  pour Bottom: 154.58,91.85 154.58,96.7 155.04,97.16 156.77,97.16 157.12,96.82 157.12,91.87 156.64,91.39 155.04,91.39
  pour Top: 156.77,97.16 157.12,96.82 157.12,91.87 156.64,91.39 155.04,91.39 154.58,91.85 154.58,96.7 155.04,97.16
N$38
  Top 0.406: U$4.2 90.84,45.5 89.7,46.63 80.36,46.63 78.28,48.71 78.28,55.43 80.69,57.84 89.27,57.84 90.85,59.41 U$3.2 90.86,61.61 90.86,63.8 91.31,64.26 93.98,64.26 96.22,66.5 96.22,73.33 94.72,74.83 91.92,74.83 90.17,76.58 90.17,94.21 88.37,96.01 86.12,96.01 J2.4
N$39
  Top 0.406: R13.2 21.29,30.03 Q8.1
N$40  (via drill 0.6)
  Top 1.016: F1.1 140.74,72.54 v140.74,75.67 v140.74,77.11 v140.74,78.72
  Bottom 1.016: J1.1 J1.2 142.34,87.83 140.74,86.23 v140.74,75.67
N$41
  Top 0.406: PS1.6 PS1.5 PS1.4
  Top 1.016: R_PWRL_UP.1 145.26,56.82 | 145.26,56.82 B1.+ | 145.26,56.82 145.24,56.8 145.24,52.12 143.68,50.57 143.05,50.57 | 143.05,50.57 PS1.5 | C_IN.+ 142.84,50.35 143.05,50.57
N$43
  Top 0.406: U$10.2 18.84,45.59 18.05,46.38 8.65,46.38 6.09,48.95 6.09,55.8 8.68,58.4 17.87,58.4 18.84,59.36 U$9.2 18.82,61.62 18.82,65.94 22.91,70.03 22.91,95.1 22.01,96 J5.4
N$48
  Top 0.406: PS1.10 134.37,53.82 R_DLY.1
N$49
  Top 0.406: PS1.14 126.68,51.87 125.94,52.6 122.43,52.6 | 122.43,52.6 121.67,53.37 121.67,54.03 121.49,54.21 R16.2 | 122.43,52.6 122.31,52.6 121.9,52.2 R15.1
N$51
  Top 0.406: 124.64,45.07 C_BST2.1 124.51,45.29 | PS1.20 127.19,47.97 125.01,45.78 124.51,45.29 | 124.51,45.29 123.95,44.73
  Top 1.016: L1.2 126.68,38.45 125.36,39.78 125.35,39.78 124.51,40.62 C_BST2.1
N$52
  Top 0.406: PS1.15 124.94,51.22 R_PG.2
N$53
  Top 0.406: U$6.5 R23.1
N$54
  Top 0.406: PS1.19 126.75,48.62 125.18,47.04 122.94,47.04 121.71,45.81 C_BST2.2 | PS1.19
N$55
  Top 0.406: PS1.2 135.13,48.62 135.82,47.93 135.82,46.28 136.3,45.8 C_BST1.1
  Top 1.016: C_BST1.1 137.78,39.78 136.45,38.46 L1.1
N$56
  Top 0.406: PS1.3 135.68,49.27 136.35,48.59 C_BST1.2
N$57
  Top 0.406: PS1.12 PS1.11 127.86,53.82 C_REG.1
N$58
  Top 0.406: PS1.8 135.12,52.52 135.54,52.94 135.54,53.55 135.87,53.88 140.17,53.88 | R_PWRL_DOWN.1 140.1,53.95 arc90 140.17,53.88 | 140.17,53.88 142.34,53.88 142.82,54.36 R_PWRL_UP.2
N$59
  Top 0.406: R20.1 U$3.5
N$60
  Top 0.406: R22.1 85.66,35.96 U$4.5
N$61
  Top 0.406: U$5.5 57.29,54.86 R21.1
N$62
  Top 0.406: R27.1 U$10.5
N$63
  Top 0.406: R24.1 U$7.5
N$64
  Top 0.406: R25.1 U$8.5
N$65
  Top 0.406: R26.1 U$9.5
VCC_3_3  (via drill 0.6)
  Top 0.406: R5.2 OK1.8 114.58,62.77 R3.2 | R5.2 | IC3.5 108.46,70.98 v109.64,72.17 | R5.2 v110.91,62.77
  Bottom 0.406: v110.91,62.77 v110.91,62.78 R5.2 111.57,65.53 111.57,71.28 110.69,72.17 v109.64,72.17 108.08,73.74 67.26,73.74 65.84,72.32 CN6.4
VCC_6-8  (via drill 0.6)
  Top 0.406: R_PG.1 124.8,49.71 125.74,49.71 125.79,49.76 126.19,49.76 126.35,49.92 PS1.17 PS1.16 126.97,50.57 126.97,50.55 126.14,49.71 | 57.19,31.05 v57.17,31.03 57.22,31.08 | 57.22,50.08 v57.17,50.03 57.19,50.05 | 81.22,31.08 81.17,31.03 v81.14,31.06 | 81.22,50.08 v81.17,50.03 81.14,50.06 | 36.03,31.03 D7.C | 33.17,34.14 R25.2 | v9.22,31.08 9.17,31.03 | 9.17,34.14 R27.2 | 9.22,50.08 v9.17,50.03 | 9.17,53.13 R26.2 | 33.17,53.13 R24.2 | 36.13,50.03 D5.C | D4.C 60.09,31.03
  Top 1.016: R23.2 57.19,31.05 | D3.C 57.22,50.08 | R21.2 57.19,50.05 | D6.C 81.22,31.08 | R22.2 v81.14,31.06 | D2.C 81.22,50.08 | R20.2 81.14,50.06 | 36.03,31.03 v33.17,31.03 33.17,34.14 | 9.17,31.03 9.17,34.14 | D8.C 9.22,50.08 | v9.17,50.03 9.17,53.13 | 33.17,53.13 v33.17,50.03 36.13,50.03 | 60.09,31.03 v57.17,31.03 | D9.C v9.22,31.08
  Bottom 0.406: v81.13,32.51 v81.14,32.51 v81.14,31.06 | v57.2,32.51 57.17,32.51 v57.17,31.03 | v33.17,32.51 v33.17,31.03 | v9.17,32.51 9.22,32.51 v9.22,31.08
  Bottom 1.016: 81.08,49.94 v81.17,50.03 | CN6.8 76,58.21 80.42,53.8 80.42,52.27 v81.17,51.51
  Bottom 2.54: v107.59,52.09 107.57,43.34 104,39.78 81.07,39.78 | 81.07,39.78 57.17,39.78 | 57.17,39.78 33.16,39.78 | 33.16,39.78 9.17,39.78 | v9.22,31.08 9.17,31.08 9.17,39.52 | 9.17,39.52 9.17,39.78 | 81.17,31.06 v81.14,31.06 81.07,31.13 81.07,39.78 | v33.17,31.03 v33.16,31.03 33.16,39.78 | 33.16,39.78 33.17,39.78 v33.17,50.03 v33.17,51.51 | v57.17,31.03 57.17,39.78 | 57.17,39.78 v57.17,50.03 57.17,51.51 v57.2,51.51 | 9.2,39.5 9.17,39.52 | v9.17,51.51 v9.17,50.03 9.17,39.78 | 81.07,39.78 81.07,48.02 81.05,48.03
  other vias: 107.59,50.8 108.97,50.8 108.97,52.1 110.31,50.77 111.68,50.77 111.68,52.07 110.34,52.07
  pour Top: 128.07,50.07 128.1,49.89 127.26,49.89 124.67,46.81 123.6,46.43 122.79,46.38 106,46 105.39,46.84 105.39,52.83 114.99,52.86 117.1,50.14 126.57,50.01
  pour Bottom: 106.6,52.2 107.57,53.16 112.01,53.16 112.75,52.43 112.75,50.39 112.06,49.71 109.52,49.71 108.66,48.84 107.34,48.84 106.83,49.35 106.83,52.4 107.06,52.63
  pour Bottom: 81.84,47.78 81.84,52.37 80.29,53.92 80.29,47.47 80.59,47.78

### Text on the board
Top: Midi Switch 2.0
Bottom: Midi Switch 2.0